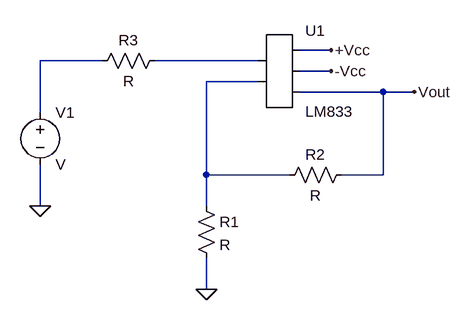
[diagram p0: schematic opamp LM833.asc]
opamp LM833.asc, the LTspice schematic file:
Version 4
SHEET 1 880 680
WIRE 288 144 240 144
WIRE -64 160 -160 160
WIRE 176 160 16 160
WIRE 288 176 240 176
WIRE 176 192 96 192
WIRE 368 208 240 208
WIRE 416 208 368 208
WIRE -160 240 -160 160
WIRE 96 336 96 192
WIRE 224 336 96 336
WIRE 368 336 368 208
WIRE 368 336 304 336
WIRE -160 384 -160 320
WIRE 96 384 96 336
WIRE 96 512 96 464
FLAG 288 144 +Vcc
FLAG 288 176 -Vcc
FLAG 96 512 0
FLAG -160 384 0
FLAG 416 208 Vout
SYMBOL AutoGenerated\\LM833 208 176 R0
SYMATTR InstName U1
SYMBOL res 80 368 R0
SYMATTR InstName R1
SYMBOL res 320 320 R90
WINDOW 0 0 56 VBottom 2
WINDOW 3 32 56 VTop 2
SYMATTR InstName R2
SYMBOL res 32 144 R90
WINDOW 0 0 56 VBottom 2
WINDOW 3 32 56 VTop 2
SYMATTR InstName R3
SYMBOL voltage -160 224 R0
SYMATTR InstName V1

The netlist it stands for:
* opamp LM833.asc
* U1: LM833 (symbol AutoGenerated\LM833 not available, pins judged from their places): pin1=N002 pin2=N003 pin3=+Vcc pin4=-Vcc pin5=Vout
R1 N003 0 R
R2 Vout N003 R
R3 N002 N001 R
V1 N001 0 V
.backanno
.end